# EAGLE design bass filter (EAGLE 7.5.0)
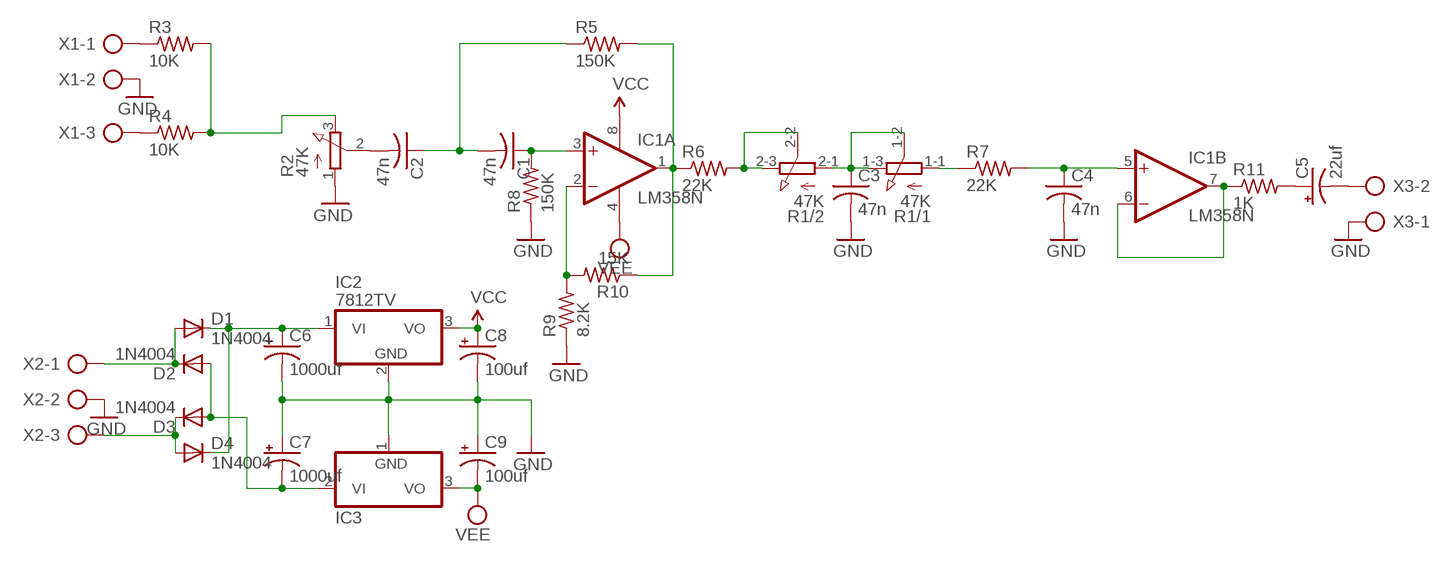
[diagram p0: schematic, sheet 1]

## Parts
C1  47n  C-US050-045X075  [C050-045X075]
C2  47n  C-US050-045X075  [C050-045X075]
C3  47n  C-US050-045X075  [C050-045X075]
C4  47n  C-US050-045X075  [C050-045X075]
C5  22uf  CPOL-USE2,5-6E  [E2,5-6E]
C6  1000uf  CPOL-USE5-13  [E5-13]
C7  1000uf  CPOL-USE5-13  [E5-13]
C8  100uf  CPOL-USE2.5-6  [E2,5-6]
C9  100uf  CPOL-USE2.5-6  [E2,5-6]
D1  1N4004  [DO41-10]
D2  1N4004  [DO41-10]
D3  1N4004  [DO41-10]
D4  1N4004  [DO41-10]
IC1  LM358N  [DIL08]
IC2  7812TV  [TO220V]
IC3  7912T  [TO220H]
R1  47K  3RP/1610G  [3RP/1610G]
R2  47K  3RP/1610N  [3RP/1610N]
R3  10K  FLIPFLOP-RES  [0805-THM]
R4  10K  FLIPFLOP-RES  [0805-THM]
R5  150K  FLIPFLOP-RES  [0805-THM]
R6  22K  FLIPFLOP-RES  [0805-THM]
R7  22K  FLIPFLOP-RES  [0805-THM]
R8  150K  FLIPFLOP-RES  [0805-THM]
R9  8.2K  FLIPFLOP-RES  [0805-THM]
R10  15K  FLIPFLOP-RES  [0805-THM]
R11  1K  FLIPFLOP-RES  [0805-THM]
X1  AK300/3  [AK300/3]
X2  AK300/3  [AK300/3]
X3  AK300/2  [AK300/2]

## Nets
GND: C3.2 C4.2 C6.- C7.+ C8.- C9.+ IC2.2(GND) IC3.1(GND) R2.1(A) R8.1 R9.1 X1.2 X2.2 X3.1
N$1: C1.1 IC1.3(A:+IN) R8.2
N$2: C1.2 C2.1 R5.1
N$3: C2.2 R2.2(S)
N$4: IC1.1(A:OUT) R5.2 R6.1 R10.1
N$5: C4.1 IC1.5(B:+IN) R7.2
N$6: R1.2-2(/2:S) R1.2-3(/2:E) R6.2
N$7: C3.1 R1.1-2(/1:S) R1.1-3(/1:E) R1.2-1(/2:A)
N$8: R1.1-1(/1:A) R7.1
N$9: IC1.2(A:-IN) R9.2 R10.2
N$10: R2.3(E) R3.2 R4.2
N$11: IC1.6(B:-IN) IC1.7(B:OUT) R11.1
N$12: C5.+ R11.2
N$13: R3.1 X1.1
N$14: C5.- X3.2
N$15: R4.1 X1.3
N$16: D1.A D2.C X2.1
N$17: D3.C D4.A X2.3
N$18: C7.- D2.A D3.A IC3.2(VI)
N$19: C6.+ D1.C D4.C IC2.1(VI)
VCC: C8.+ IC1.8(P:V+) IC2.3(VO)
VEE: C9.- IC1.4(P:V-) IC3.3(VO)

## Library data of the parts
C1-C4 = adafruit:C-US: CAPACITOR, American symbol
C5-C9 = adafruit:CPOL-US: POLARIZED CAPACITOR, American symbol
D1-D4 = adafruit:1N4004: DIODE General purpose 1N400x type rectifier (With bigger pads) http://www.ladyada.net/library/pcb/eaglelibrary.html
IC1 = linear:LM358: OP AMP also LM158; LM258; LM2904 Source: http://cache.national.com/ds/LM/LM158.pdf
IC2 = linear:78*: Positive VOLTAGE REGULATOR Source: http://cache.national.com/ds/LM/LM78L05.pdf http://www.fairchildsemi.com/ds/LM/LM7805.pdf
IC3 = linear:79*: Negative VOLTAGE REGULATOR
R1 = pot:3RP/1610G: 16mm Potentiometer two level Source: http://www.alphapotentiometers.net/html/16mm_pot_2.html
R2 = pot:3RP/1610N: 16mm Potentiometer one level Source: http://www.alphapotentiometers.net/html/16mm_pot_2.html
R3-R11 = adafruit:FLIPFLOP-RES: Flip Flop resistor An 0805 resistor inside a standard 1/4W 5% resistor. Makes for easy mods
X1 X2 = con-ptr500:AK300/3: CONNECTOR; OC_FARNELL: unknown; OC_NEWARK: unknown
X3 = con-ptr500:AK300/2: CONNECTOR; OC_FARNELL: unknown; OC_NEWARK: unknown

## Board
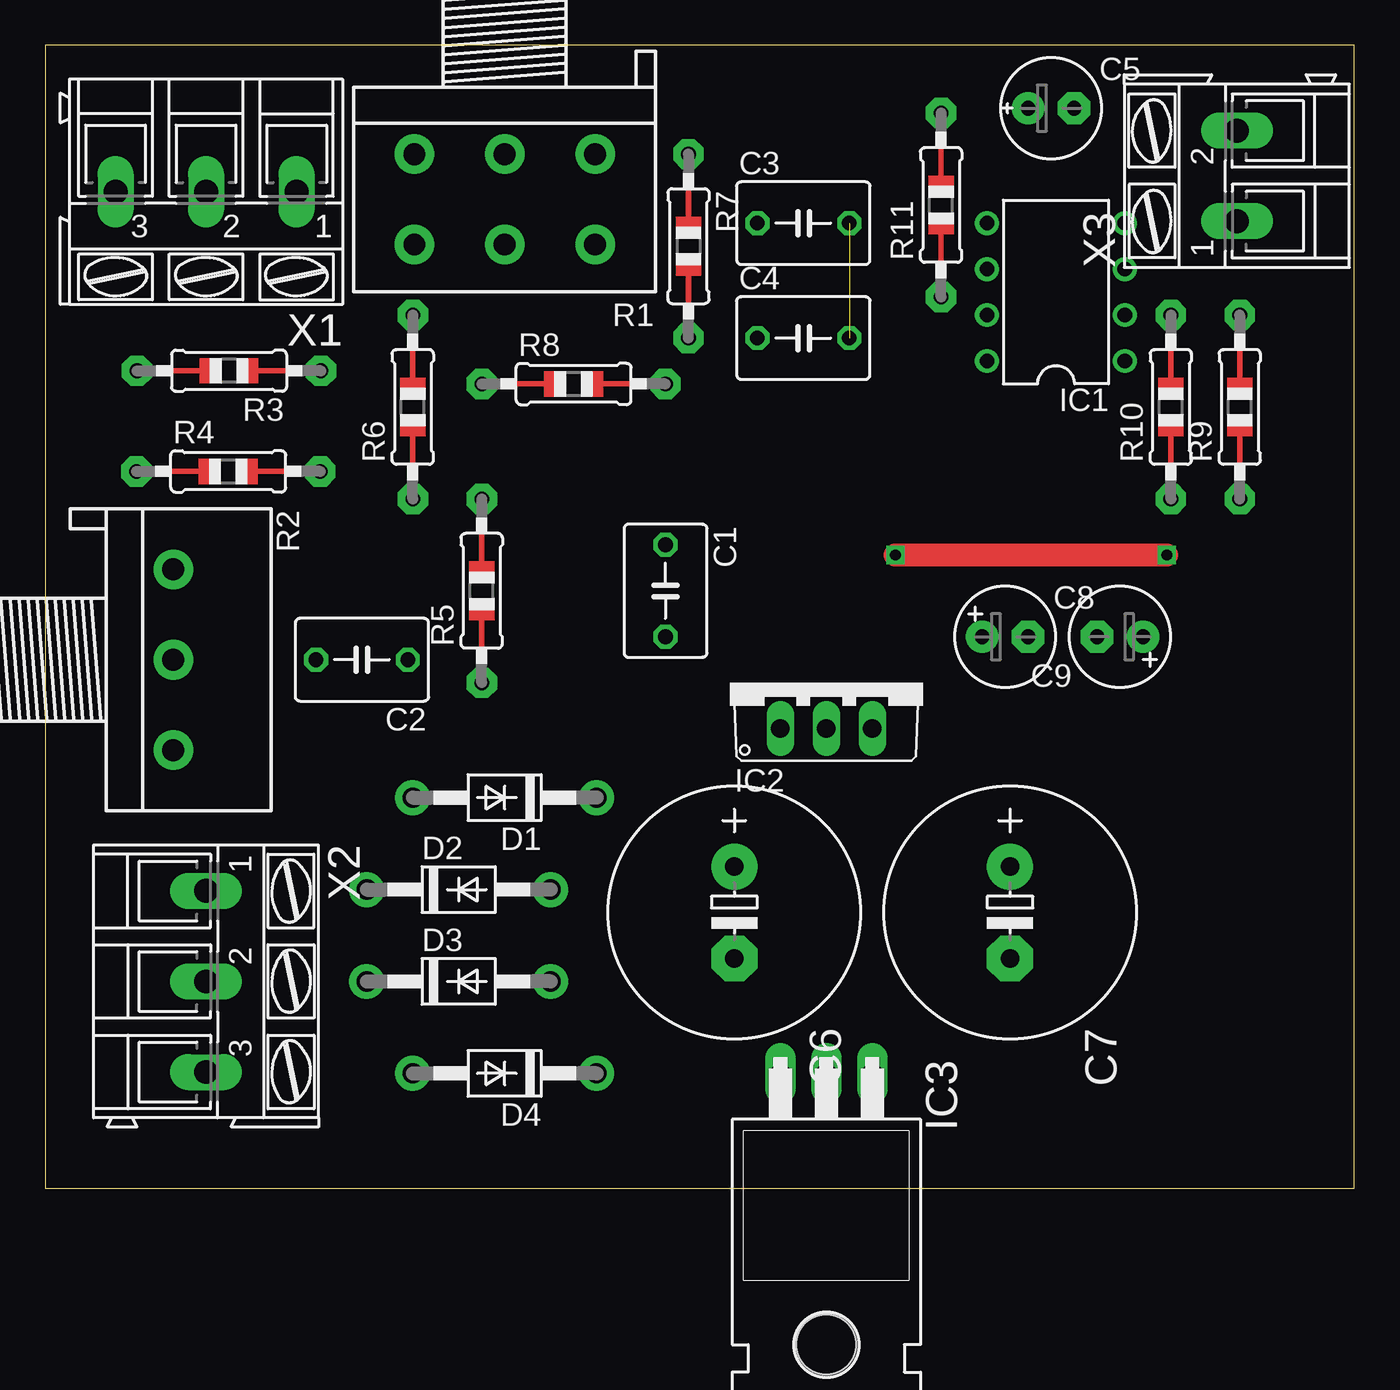
[diagram p1: board, top side]
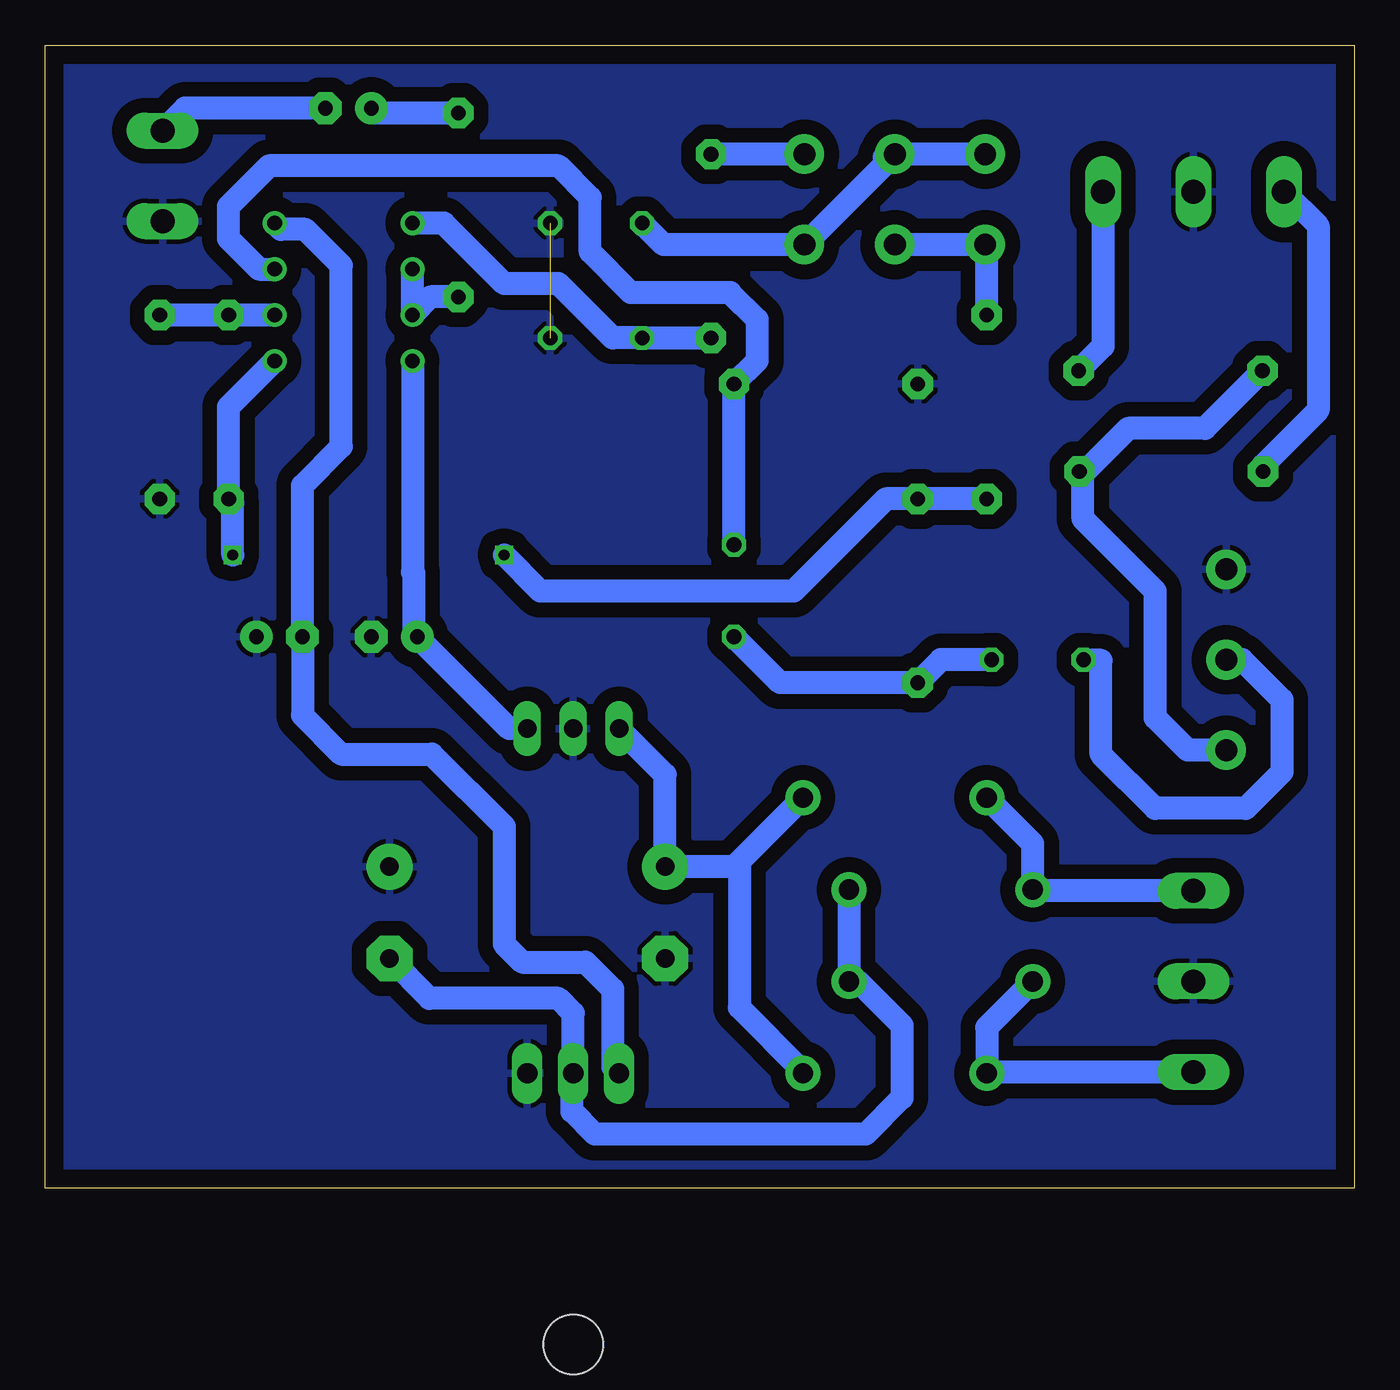
[diagram p2: board, bottom side, seen from below]

Size 72.37 x 63.17 mm. Coordinates in mm from the lower left corner, seen from the top.
Outline: 0,0 72.37,0 72.37,63.17 0,63.17 0,0
Copper layers (1*16): Top 0.035mm / dielectric 1.5mm / Bottom 0.035mm
Design rules "default": minimum track width 10mil, minimum drill 24mil, track to track 8mil, track to pad 8mil, pad to pad 8mil, via to via 8mil, smd to smd 8mil, copper to edge 40mil, drill to drill 8mil, minimum pad ring 10mil, minimum via ring 8mil, stop-mask expansion 4mil, vias tented up to drill 0mil, thermal gap 10mil

### Footprints (pad centres in the part's own frame; a part is rotated, then mirrored left to right if it is on the bottom)
C050-045X075 = drill 0.813 octagon: 1 -2.54,0; 2 2.54,0
E2,5-6E = drill 0.813 pad 1.778: + -1.27,0 | drill 0.813 pad 1.778 octagon: - 1.27,0
E5-13 = drill 1.016 pad 2.54: + -2.54,0 | drill 1.016 pad 2.54 octagon: - 2.54,0
E2,5-6 = drill 0.813 pad 1.778: + -1.27,0 | drill 0.813 pad 1.778 octagon: - 1.27,0
DO41-10 = drill 1.118 pad 1.93: A 5.08,0; C -5.08,0
DIL08 = drill 0.813 pad 1.27: 1 -3.81,-3.81; 2 -1.27,-3.81; 3 1.27,-3.81; 4 3.81,-3.81; 5 3.81,3.81; 6 1.27,3.81; 7 -1.27,3.81; 8 -3.81,3.81
TO220V = drill 1.016 long: 1 -2.54,-2.54; 2 0,-2.54; 3 2.54,-2.54
TO220H = drill 1.118 long: 1 -2.54,-10.16; 2 0,-10.16; 3 2.54,-10.16 | hole 3.302: 0,4.826
3RP/1610G = drill 1.2 pad 2.184: 1-1 -5,0; 1-2 0,0; 1-3 5,0; 2-1 -5,5; 2-2 0,5; 2-3 5,5
3RP/1610N = drill 1.2 pad 2.184: 1 -5,0; 2 0,0; 3 5,0
0805-THM = drill 0.813 pad 1.676 octagon: 1 -5.08,0; 2 5.08,0
AK300/3 = drill 1.321 long: 1 -5.004,0; 2 0,0; 3 5.004,0
AK300/2 = drill 1.321 long: 1 -2.515,0; 2 2.489,0

### Placement (x,y rotation side)
C1  34.29,33.02 270 top
C2  17.51,29.21 180 top
C3  41.91,53.34 0 top
C4  41.91,46.99 0 top
C5  55.61,59.69 0 top
C6  38.1,15.24 270 top
C7  53.34,15.24 270 top
C8  53.07,30.48 0 top
C9  59.42,30.48 180 top
D1  25.4,21.59 180 top
D2  22.86,16.51 0 top
D3  22.86,11.43 0 top
D4  25.4,6.35 180 top
IC1  55.88,49.53 90 top
IC2  43.18,27.94 0 top
IC3  43.18,-3.81 180 top
R1  25.4,57.15 180 top
R2  7.08,29.21 270 top
R3  10.16,45.18 180 top
R4  10.12,39.62 0 top
R5  24.13,33.02 90 top
R6  20.32,43.18 90 top
R7  35.56,52.07 270 top
R8  29.21,44.45 0 top
R9  66.04,43.18 90 top
R10  62.23,43.18 90 top
R11  49.53,54.34 90 top
X1  8.89,55.07 180 top
X2  8.89,11.43 270 top
X3  65.88,55.96 90 top

### Tracks (layer width: path | path; a pad name or v marks a point on that pad's centre or on a via)
GND  (1 unrouted)
  pour Bottom (isolate 0.813): 0,63.5 72.39,63.5 72.39,0 0,0
N$1
  Bottom 1.27: C1.1 R8.2 33,45.74 33,48 34.5,49.5 40,49.5 42.25,51.75 42.25,54.75 44,56.5 60,56.5 62.25,54.25 62.25,52.5 60.55,50.8 IC1.3
N$2
  Bottom 1.27: C2.1 22.86,29.21 R5.1 31.75,27.94 C1.2
N$3
  Bottom 1.27: R2.2 6.21,29.21 4,27 4,23 6,21 11,21 14,24 14,29.18 C2.2
N$4  (via drill 0.6)
  Top 1.27: v47,35 v62,35
  Bottom 1.27: R6.1 R5.2 25.9,38.1 31,33 45,33 v47,35 | v62,35 62,37.87 R10.1 62.23,43.18 IC1.1
N$5
  Bottom 1.27: R7.2 C4.1 41,47 44,50 47,50 50.34,53.34 IC1.5
N$6
  Bottom 1.27: R6.2 20.32,52.07 R1.2-3 R1.2-2
N$7
  Bottom 1.27: R1.1-3 R1.1-2 | R1.1-2 25.85,57.15 26,57 25.55,57 R1.1-2 | R1.1-2 R1.2-1 38.18,52.15 C3.1
N$8
  Bottom 1.27: R1.1-1 R7.1
N$9
  Bottom 1.27: IC1.2 R10.2 R9.2
N$10
  Bottom 1.27: R3.2 8.26,42 12.5,42 14.88,39.62 R4.2 15,39.42 15,37 11,33 11,26 9.21,24.21 R2.3
N$11
  Bottom 1.27: R11.1 51.07,49.26 IC1.7 IC1.6
N$12
  Bottom 1.27: R11.2 54.07,59.42 C5.+
N$13
  Bottom 1.27: X1.1 13.89,46.53 R3.1
N$14
  Bottom 1.27: C5.- 64.64,59.69 X3.2
N$15
  Bottom 1.27: X1.3 2,53.18 2,43 5.04,39.96 R4.1
N$16
  Bottom 1.27: X2.1 17.7,16.43 D2.C 17.78,19.05 D1.A
N$17
  Bottom 1.27: X2.3 20.24,6.43 D4.A 20.32,8.89 D3.C
N$18
  Bottom 1.27: C7.- 51.14,10.5 44,10.5 43.18,9.68 IC3.2 43.25,6.28 43.25,4.25 42,3 27,3 25,5 25,9 27.43,11.43 D3.A D2.A
N$19
  Bottom 1.27: IC2.1 38.1,22.86 C6.+ 34.29,17.78 34,18.07 | D1.C 34,18.07 | 34,18.07 34,10 30.48,6.48 D4.C
VCC
  Bottom 1.27: IC1.8 52.07,34.07 52,34 52,30.68 C8.+ 46.72,25.4 IC2.3
VEE
  Bottom 1.27: IC1.4 59.35,53 58,53 56,51 56,41 58.15,38.85 C9.- 58.15,26.15 56,24 51,24 47,20 47,13.5 46,12.5 42.5,12.5 41,11 41,6.71 IC3.3